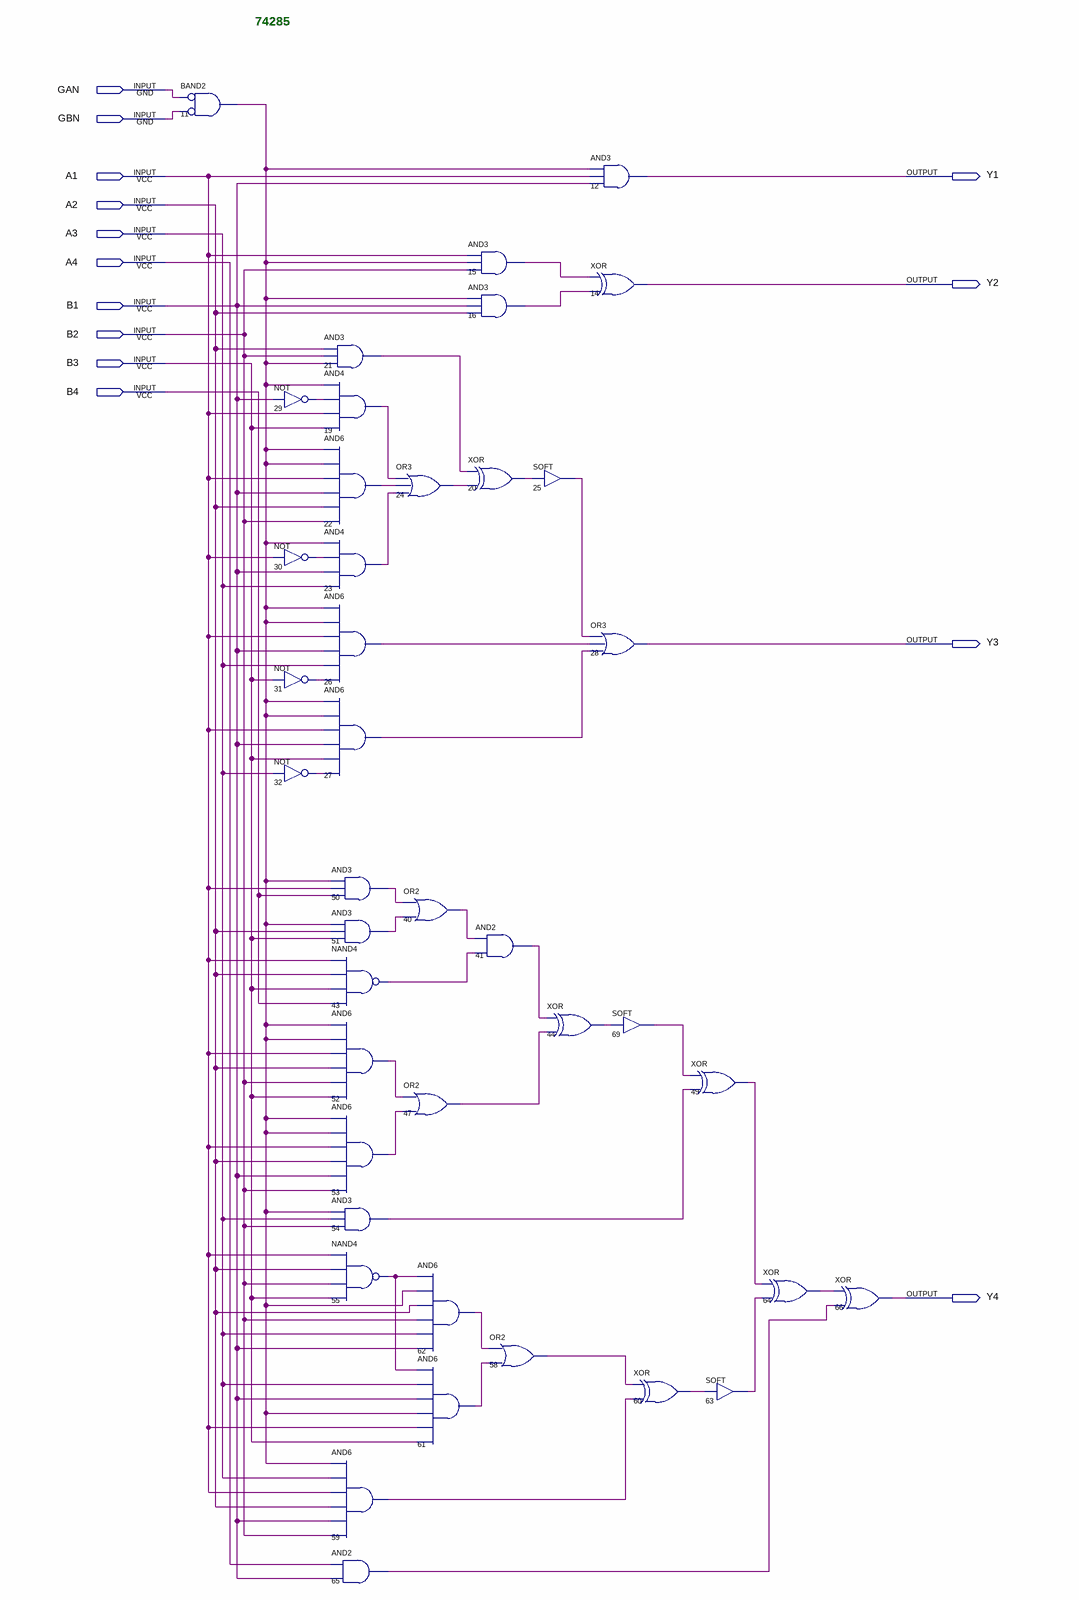
[diagram p0: schematic sheet]
// Quartus schematic 74285.bdf as structural Verilog: 41 symbols, 14 pins
module \74285  (
  input  GAN,
  input  GBN,
  input  A1,
  input  A2,
  input  A3,
  input  A4,
  input  B1,
  input  B2,
  input  B3,
  input  B4,
  output Y1,
  output Y2,
  output Y3,
  output Y4
);

  wire n11_out, n15_out, n16_out, n19_out, n20_out, n21_out, n22_out, n23_out, n24_out, n25_out, n26_out,
       n27_out, n29_out, n30_out, n31_out, n32_out, n40_out, n41_out, n43_out, n44_out, n47_out, n49_out,
       n50_out, n51_out, n52_out, n53_out, n54_out, n55_out, n58_out, n59_out, n60_out, n61_out, n62_out,
       n63_out, n64_out, n65_out, n69_out;

  and u_11 (n11_out, ~GAN, ~GBN);  // BAND2
  not u_29 (n29_out, B1);
  not u_30 (n30_out, A1);
  not u_31 (n31_out, B3);
  not u_32 (n32_out, A3);
  and u_21 (n21_out, A2, B2, n11_out);
  and u_19 (n19_out, n11_out, n29_out, A1, B3);
  and u_22 (n22_out, n11_out, n11_out, A1, B1, A2, B2);
  and u_23 (n23_out, n11_out, n30_out, B1, A3);
  and u_26 (n26_out, n11_out, n11_out, A1, B1, A3, n31_out);
  and u_27 (n27_out, n11_out, n11_out, A1, B1, B3, n32_out);
  and u_50 (n50_out, n11_out, A1, B4);
  and u_51 (n51_out, n11_out, A2, B3);
  nand u_43 (n43_out, A1, A2, B3, B4);
  and u_52 (n52_out, n11_out, n11_out, A1, A2, B2, B3);
  and u_53 (n53_out, n11_out, n11_out, A1, A2, B1, B2);
  and u_54 (n54_out, n11_out, A3, B2);
  nand u_55 (n55_out, A1, A2, B2, B3);
  and u_59 (n59_out, n11_out, A3, A1, A2, B1, B2);
  and u_65 (n65_out, A4, B1);
  or u_24 (n24_out, n19_out, n22_out, n23_out);
  or u_40 (n40_out, n50_out, n51_out);
  or u_47 (n47_out, n52_out, n53_out);
  and u_62 (n62_out, n55_out, n11_out, A2, B2, A3, B1);
  and u_61 (n61_out, n55_out, A3, B1, n11_out, A1, B3);
  and u_15 (n15_out, A1, n11_out, B2);
  and u_16 (n16_out, n11_out, B1, A2);
  xor u_20 (n20_out, n21_out, n24_out);
  and u_41 (n41_out, n40_out, n43_out);
  or u_58 (n58_out, n62_out, n61_out);
  SOFT u_25 (.IN(n20_out), .OUT(n25_out));
  xor u_44 (n44_out, n41_out, n47_out);
  and u_12 (Y1, n11_out, A1, B1);
  xor u_14 (Y2, n15_out, n16_out);
  or u_28 (Y3, n25_out, n26_out, n27_out);
  SOFT u_69 (.IN(n44_out), .OUT(n69_out));
  xor u_60 (n60_out, n58_out, n59_out);
  xor u_49 (n49_out, n69_out, n54_out);
  SOFT u_63 (.IN(n60_out), .OUT(n63_out));
  xor u_64 (n64_out, n49_out, n63_out);
  xor u_66 (Y4, n64_out, n65_out);

  // Notes on the sheet:
  //   74285
endmodule
